# Altium project usomiq-bone-cape.PrjPcb
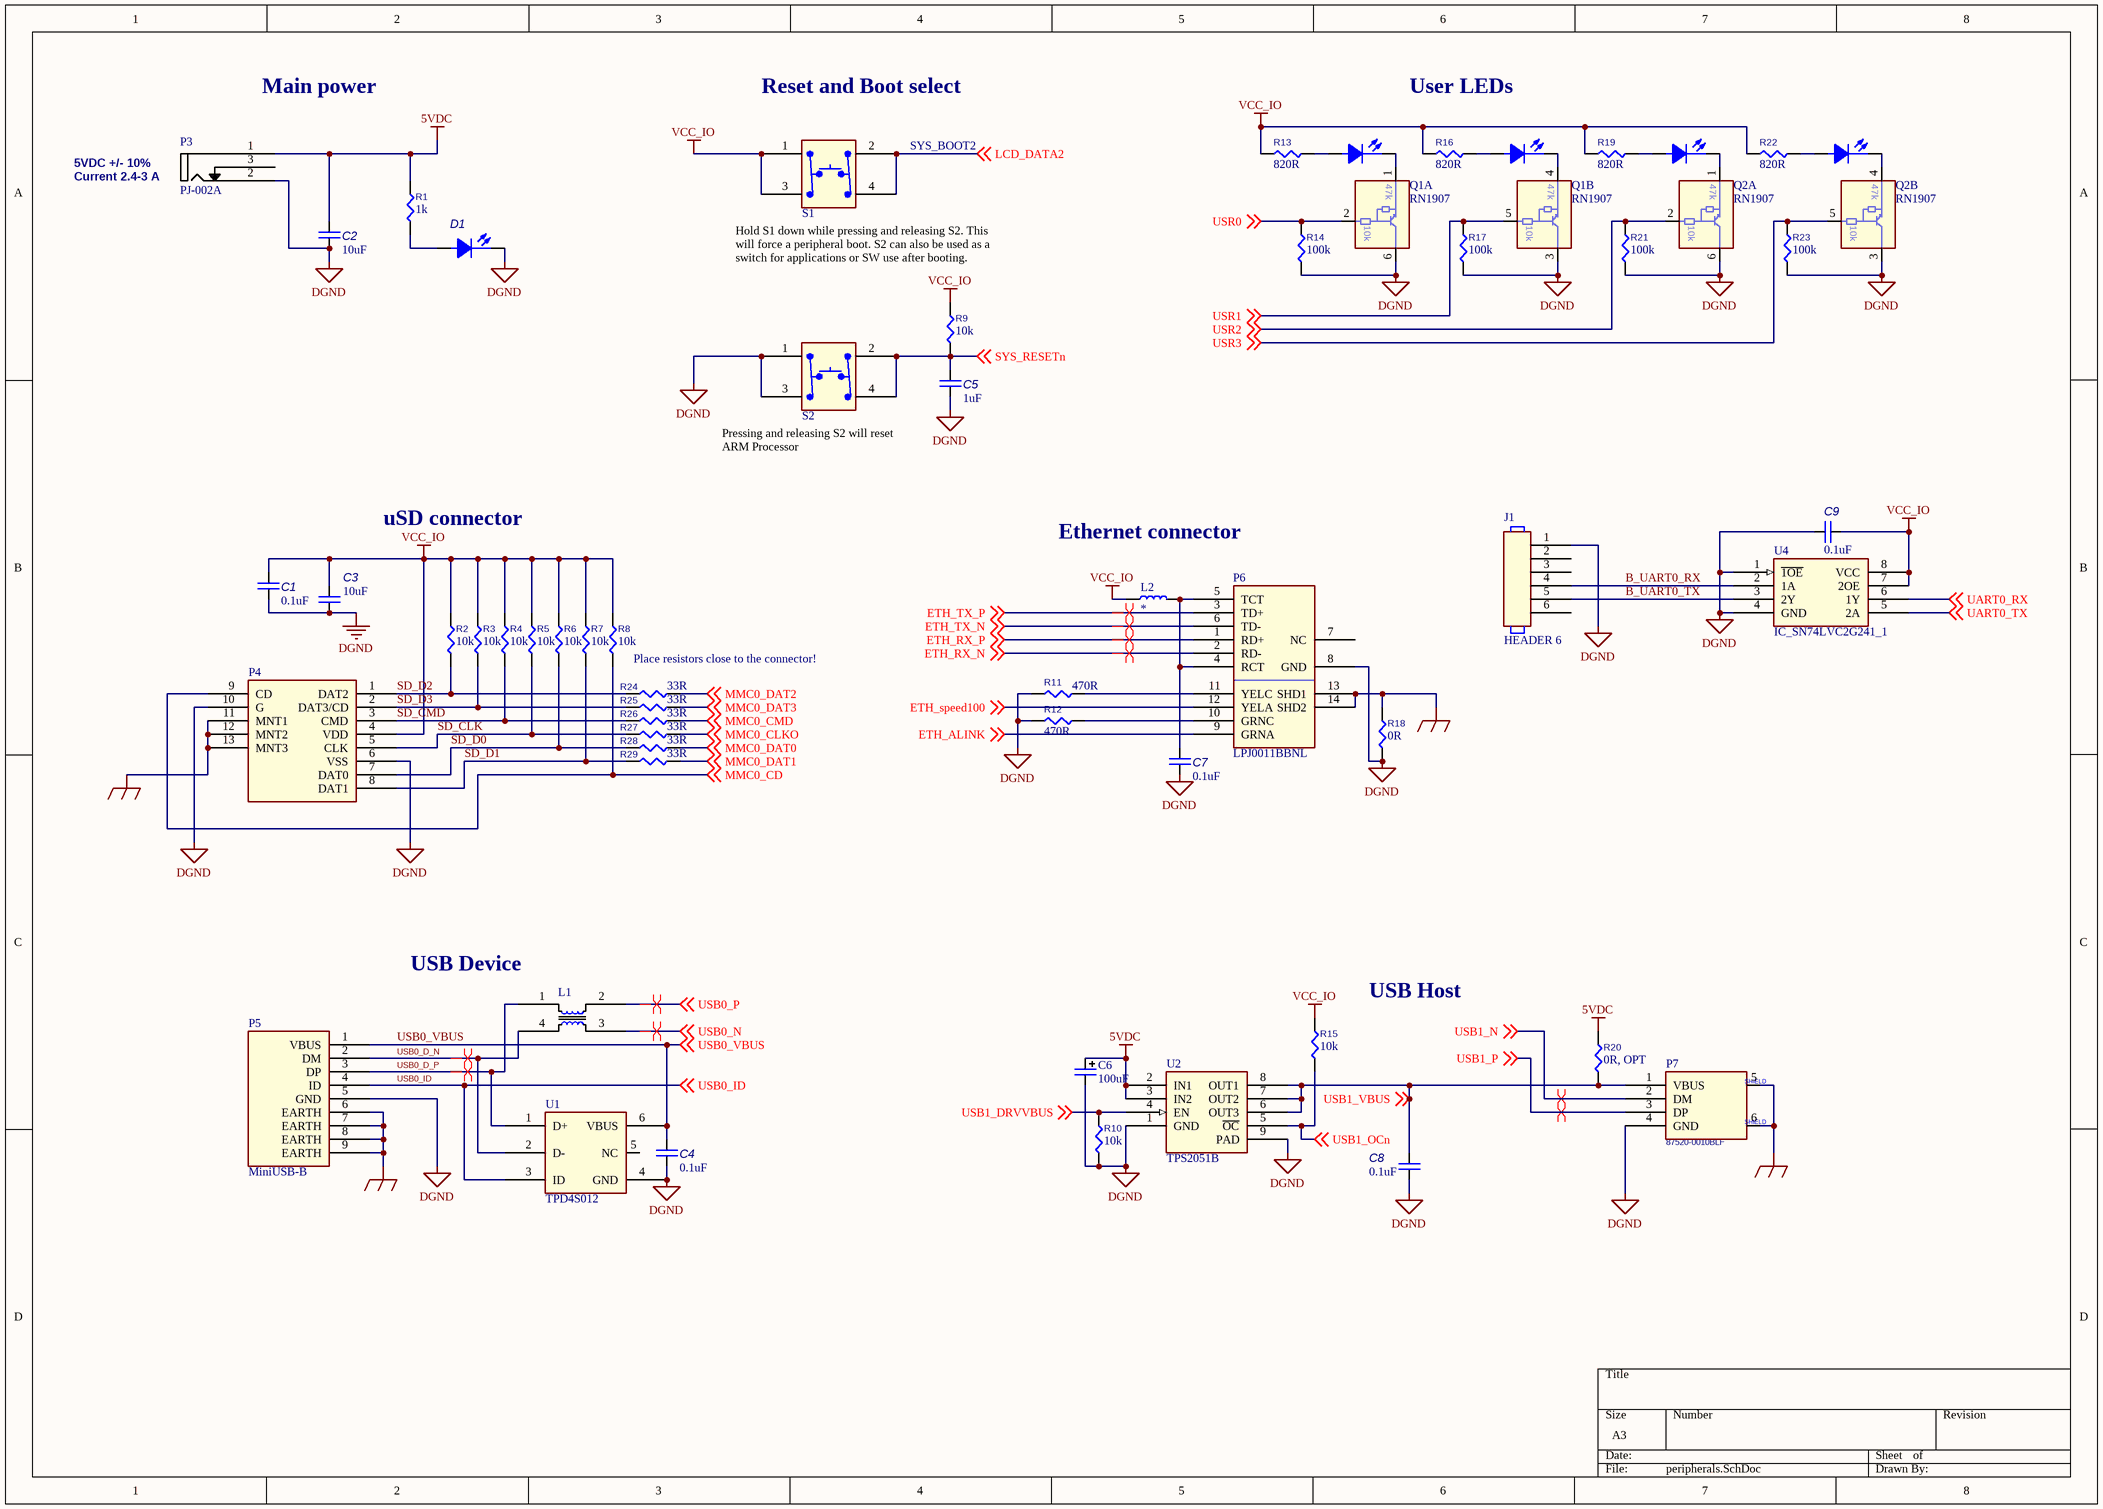
[diagram p0: peripherals.SchDoc]
2 sheets, 59 parts. Net scope: global (net labels, ports and power ports of the same name join across sheets).
Board file: usomiq-bone-cape.PcbDoc
Sheets:
  peripherals.SchDoc
  usomiq.SchDoc

## Sheet peripherals.SchDoc
size A3

### Parts
C1  value 0.1uF  [CC1608-0603]  (hidden comment: C0603)
C2  value 10uF  [CC2012-0805]  (hidden comment: C0805)
C3  value 10uF  [CC2012-0805]  (hidden comment: C0805)
C4  value 0.1uF  [CC1608-0603]  (hidden comment: C0603)
C5  value 1uF  [CC1608-0603]  (hidden comment: C0603)
C6  value 100uF  [Cap_C]  (hidden comment: Cap_C)
C7  value 0.1uF  [CC1608-0603]  (hidden comment: C0603)
C8  value 0.1uF  [CC1608-0603]  (hidden comment: C0603)
C9  value 0.1uF  [CC1608-0603]  (hidden comment: C0603)
D1  LED0805  [LED0805]  (value not drawn)
D2  LED0805  [LED0805]  (value not drawn)
D3  LED0805  [LED0805]  (value not drawn)
D4  LED0805  [LED0805]  (value not drawn)
D5  LED0805  [LED0805]  (value not drawn)
J1  HEADER 6  [DIP6]
L1  DLW21H  [DLW21H]  (value not drawn)
L2  BLM18A-FB  [CHIP0603]  (value not drawn)
P3  PJ-002A  [PJ-002A]
P4  (no value)  [TFC08WP01F-A-R1K-H]
P5  MiniUSB-B  [MINI-USB-B5 SMT]
P6  P/N: LPJ0011BBNL  [TRJ0011ABNL]  (hidden comment: CONN_RJ45_MAG_WE_0)
P7  P/N: 87520-0010BLF  [USB2.5-2H4C]  (hidden comment: CONN_54819-0578_2)
Q1  RN1907  [SOT363-6L]  (parts A,B of 2)
Q2  RN1907  [SOT363-6L]  (parts A,B of 2)
R1  value 1k  [RESC1608X55N]  (hidden comment: R0603)
R2  value 10k  [RESC1608X55N]  (hidden comment: R0603)
R3  value 10k  [RESC1608X55N]  (hidden comment: R0603)
R4  value 10k  [RESC1608X55N]  (hidden comment: R0603)
R5  value 10k  [RESC1608X55N]  (hidden comment: R0603)
R6  value 10k  [RESC1608X55N]  (hidden comment: R0603)
R7  value 10k  [RESC1608X55N]  (hidden comment: R0603)
R8  value 10k  [RESC1608X55N]  (hidden comment: R0603)
R9  value 10k  [RESC1608X55N]  (hidden comment: R0603)
R10  value 10k  [RESC1608X55N]  (hidden comment: R0603)
R11  value 470R  [RESC1608X55N]  (hidden comment: R0603)
R12  value 470R  [RESC1608X55N]  (hidden comment: R0603)
R13  value 820R  [RESC1608X55N]  (hidden comment: R0603)
R14  value 100k  [RESC1608X55N]  (hidden comment: R0603)
R15  value 10k  [RESC1608X55N]  (hidden comment: R0603)
R16  value 820R  [RESC1608X55N]  (hidden comment: R0603)
R17  value 100k  [RESC1608X55N]  (hidden comment: R0603)
R18  value 0R  [RESC1608X55N]  (hidden comment: R0603)
R19  value 820R  [RESC1608X55N]  (hidden comment: R0603)
R20  value 0R, OPT  [RESC1608X55N]  (hidden comment: R0603)
R21  value 100k  [RESC1608X55N]  (hidden comment: R0603)
R22  value 820R  [RESC1608X55N]  (hidden comment: R0603)
R23  value 100k  [RESC1608X55N]  (hidden comment: R0603)
R24  value 33R  [RESC1608X55N]  (hidden comment: R0603)
R25  value 33R  [RESC1608X55N]  (hidden comment: R0603)
R26  value 33R  [RESC1608X55N]  (hidden comment: R0603)
R27  value 33R  [RESC1608X55N]  (hidden comment: R0603)
R28  value 33R  [RESC1608X55N]  (hidden comment: R0603)
R29  value 33R  [RESC1608X55N]  (hidden comment: R0603)
S1  SW_KT11P2JM_2  [KMR231GLFS]  (value not drawn)
S2  SW_KT11P2JM_2  [KMR231GLFS]  (value not drawn)
U1  TPD4S012  [s-puson-n6]
U2  TPS2051B  [R-PDSO-G8]
U4  IC_SN74LVC2G241_1  [SOP127P600-8N]

### Nets
5VDC: C2.2 C6.1 P3.1(GND) R1.2 R20.2 U2.2(IN1) U2.3(IN2)
DGND: C1.2 C2.1 C3.1 C4.2 C5.2 C6.2 C7.2 C8.1 C9.1 D1.2(C) J1.1 P3.2(RIGHT) P4.6(VSS) P4.10(G) P5.5(GND) P6.8(GND) P7.4(GND) Q1.3 Q1.6 Q2.3 Q2.6 R10.1 R11.1 R12.1 R14.1 R17.1 R18.1 R21.1 R23.1 S2.1(A1) S2.3(A2) U1.4(GND) U2.1(GND) U2.9(PAD) U4.1(~{1OE}) U4.4(GND)
EARTH: P4.11(MNT1) P4.12(MNT2) P4.13(MNT3) P5.6(EARTH) P5.7(EARTH) P5.8(EARTH) P5.9(EARTH) P6.13(SHD1) P6.14(SHD2) P7.5(SHELD1) P7.6(PAD4) R18.2
VCC_IO: C1.1 C3.2 C9.2 L2.1 P4.4(VDD) R2.2 R3.2 R4.2 R5.2 R6.2 R7.2 R8.2 R9.2 R13.2 R15.2 R16.2 R19.2 R22.2 S1.1(A1) S1.3(A2) U4.7(2OE) U4.8(VCC)
B_UART0_RX: J1.4 U4.2(1A)
B_UART0_TX: J1.5 U4.3(2Y)
ETH_ALINK: P6.9(GRNA) ; off-sheet ETH_ALINK
ETH_RX_N: P6.2(RD-) ; off-sheet ETH_RX_N
ETH_RX_P: P6.1(RD+) ; off-sheet ETH_RX_P
ETH_speed100: P6.12(YELA) ; off-sheet ETH_speed100
ETH_TX_N: P6.6(TD-) ; off-sheet ETH_TX_N
ETH_TX_P: P6.3(TD+) ; off-sheet ETH_TX_P
LCD_DATA2: S1.2(B1) S1.4(B2) ; off-sheet LCD_DATA2
MMC0_CD: P4.9(CD) R8.1 ; off-sheet MMC0_CD
MMC0_CLKO: R27.2 ; off-sheet MMC0_CLKO
MMC0_CMD: R26.2 ; off-sheet MMC0_CMD
MMC0_DAT0: R28.2 ; off-sheet MMC0_DAT0
MMC0_DAT1: R29.2 ; off-sheet MMC0_DAT1
MMC0_DAT2: R24.2 ; off-sheet MMC0_DAT2
MMC0_DAT3: R25.2 ; off-sheet MMC0_DAT3
SD_CLK: P4.5(CLK) R5.1 R27.1
SD_CMD: P4.3(CMD) R4.1 R26.1
SD_D0: P4.7(DAT0) R6.1 R28.1
SD_D1: P4.8(DAT1) R7.1 R29.1
SD_D2: P4.1(DAT2) R2.1 R24.1
SD_D3: P4.2(DAT3/CD) R3.1 R25.1
SYS_RESETn: C5.1 R9.1 S2.2(B1) S2.4(B2) ; off-sheet SYS_RESETn
UART0_RX: U4.6(1Y) ; off-sheet UART0_RX
UART0_TX: U4.5(2A) ; off-sheet UART0_TX
USB0_D_N: L1.4 P5.2(DM) U1.2(D-)
USB0_D_P: L1.1 P5.3(DP) U1.1(D+)
USB0_ID: P5.4(ID) U1.3(ID) ; off-sheet USB0_ID
USB0_N: L1.3 ; off-sheet USB0_N
USB0_P: L1.2 ; off-sheet USB0_P
USB0_VBUS: C4.1 P5.1(VBUS) U1.6(VBUS) ; off-sheet USB0_VBUS
USB1_DRVVBUS: R10.2 U2.4(EN) ; off-sheet USB1_DRVVBUS
USB1_N: P7.2(DM) ; off-sheet USB1_N
USB1_OCn: R15.1 U2.5(~{OC}) ; off-sheet USB1_OCn
USB1_P: P7.3(DP) ; off-sheet USB1_P
USB1_VBUS: C8.2 P7.1(VBUS) R20.1 U2.6(OUT3) U2.7(OUT2) U2.8(OUT1) ; off-sheet USB1_VBUS
USR0: Q1.2 R14.2 ; off-sheet USR0
USR1: Q1.5 R17.2 ; off-sheet USR1
USR2: Q2.2 R21.2 ; off-sheet USR2
USR3: Q2.5 R23.2 ; off-sheet USR3
NetC7_1: C7.1 L2.2 P6.4(RCT) P6.5(TCT)
NetD1_1: D1.1(A) R1.1
NetD2_1: D2.1(A) R13.1
NetD2_2: D2.2(C) Q1.1
NetD3_1: D3.1(A) R16.1
NetD3_2: D3.2(C) Q1.4
NetD4_1: D4.1(A) R19.1
NetD4_2: D4.2(C) Q2.1
NetD5_1: D5.1(A) R22.1
NetD5_2: D5.2(C) Q2.4
NetP6_10: P6.10(GRNC) R12.2
NetP6_11: P6.11(YELC) R11.2

Not connected (* = marked no-connect by the designer): J1 2 3 6; P3 3(LEFT); P6 7(NC); U1 5(NC)

### Layout directives
differential pair: ETH_RX_N, ETH_RX_P, ETH_TX_N, ETH_TX_P, USB0_D_N, USB0_D_P, USB0_N, USB0_P, USB1_N, USB1_P

### Notes on the sheet
- Main power
- Reset and Boot select
- User LEDs
- SYS_BOOT2
- 5VDC +/- 10%
  Current 2.4-3 A
- Hold S1 down while pressing and releasing S2. This
  will force a peripheral boot. S2 can also be used as a
  switch for applications or SW use after booting.
- (near S2) Pressing and releasing S2 will reset ARM Processor
- uSD connector
- Ethernet connector
- Place resistors close to the connector!
- (near L1) USB Device
- USB Host
- (in symbol CONN_54819-0578_2) SHIELD

### Library data of the parts
C6 = Cap_C: Tantalum Capacitor Case C; P/N: *
D1-D5 = LED0805: LED 0805; Value: *
J1 = HEADER 6: CONN HEADER 6POS, VERTICAL,  .100 STR TIN; Mfr: FCI; P/N: 68000-406HLF
L1 = DLW21H: Low profile wire-wound common choke coil; Manufacturer: Murata; Man P/N: DLW21HN900SQ2
L2 = BLM18A-FB: Chip EMIFILr Inductor Type; Manufacturer: Murata; Man P/N: *
P3 = PJ-002A: DC POWER JACK; Manufacturer: CIU Inc; Vendor: Digi-key; Alternative P/N: DJK-02A; Man P/N: PJ-002A
P4 = TFC08WP01F-R1K-H-CN: Connector for microSD™ Card (Push-push Type); Mfr: AUK Contractors Co, LTD; P/N: TFC08WP01F-R1K-H-CN
P5 = MiniUSB-B: Mini USB Type B CONNECTOR; Mfr: Hirose; P/N: UX60SC-MB-5ST(80)
P6 = CONN_RJ45_MAG_WE_0: RJ-45 10/100 W/Magnetics; Mfr: Link PP; P/N-2: Wurth 7499011212
P7 = CONN_54819-0578_2: USB Type A Connectors; Mfr: FCI
Q1 Q2 = RN1907: Transistor Silicon NPN; Mfr: Panasonic; P/N: DMC564040R
S1 S2 = SW_KT11P2JM_2: SMD button; Mfr: C&K Components; P/N: KMR231GLFS
U1 = TPD4S012: 4-Channel USB ESD Solution with Power Clamp; Mfr: TI; P/N: TPD4S012DRYR
U2 = TPS2051B: CURRENT-LIMITED, POWER-DISTRIBUTION SWITCHES; Mfr: TI; P/N: TPS2051BDGN
U4 = IC_SN74LVC2G241_1: Dual Buffer/Driver With 3-State Outputs; Mfr: TI; P/N: SN74LVC2G241DCU
C1 C4 C5 C7-C9 = C0603: P/N: *
C2 C3 = C0805: P/N: *
R1-R29 = R0603: P/N: *

## Sheet usomiq.SchDoc
size A4
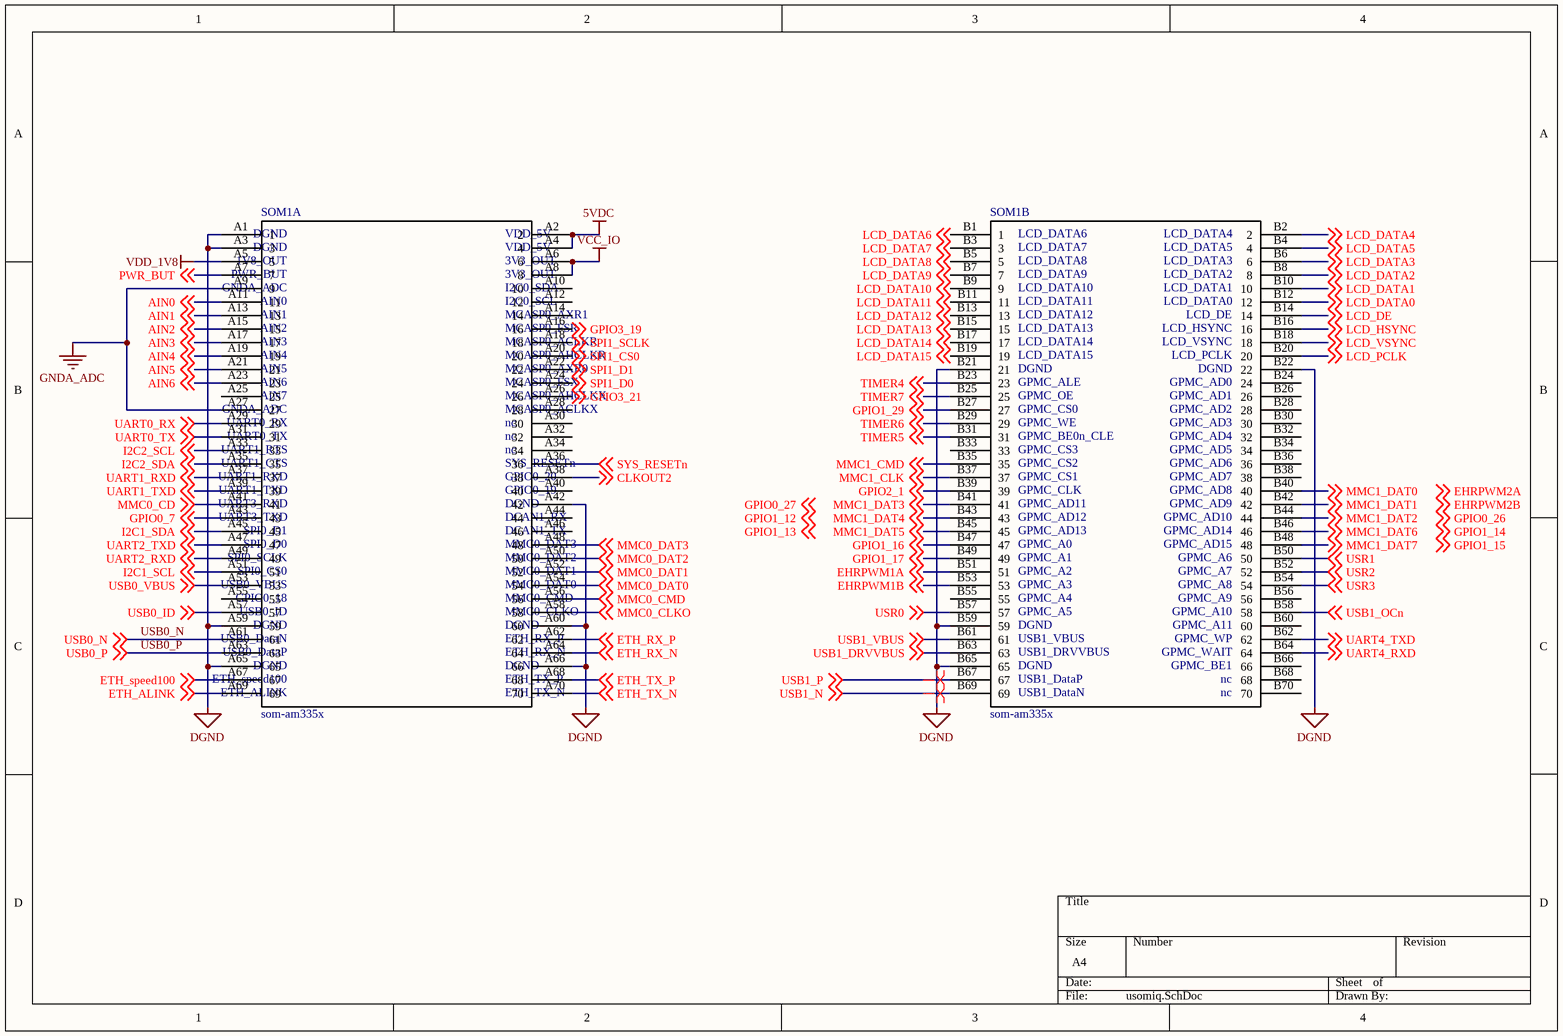
[diagram p1: usomiq.SchDoc]

### Parts
SOM1  som-am335x  [am3359_module-sockets]  (parts A,B of 2)

### Nets
5VDC: SOM1.A2(2) SOM1.A4(4)
DGND: SOM1.A1(1) SOM1.A3(3) SOM1.A42(42) SOM1.A59(59) SOM1.A60(60) SOM1.A65(65) SOM1.A66(66) SOM1.B21(21) SOM1.B22(22) SOM1.B59(59) SOM1.B65(65)
GNDA_ADC: SOM1.A9(9) SOM1.A27(27)
VCC_IO: SOM1.A6(6) SOM1.A8(8)
VDD_1V8: SOM1.A5(5)
AIN0: SOM1.A11(11) ; off-sheet AIN0
AIN1: SOM1.A13(13) ; off-sheet AIN1
AIN2: SOM1.A15(15) ; off-sheet AIN2
AIN3: SOM1.A17(17) ; off-sheet AIN3
AIN4: SOM1.A19(19) ; off-sheet AIN4
AIN5: SOM1.A21(21) ; off-sheet AIN5
AIN6: SOM1.A23(23) ; off-sheet AIN6
CLKOUT2: SOM1.A38(38) ; off-sheet CLKOUT2
EHRPWM1A: SOM1.B51(51) ; off-sheet EHRPWM1A
EHRPWM1B: SOM1.B53(53) ; off-sheet EHRPWM1B
ETH_ALINK: SOM1.A69(69) ; off-sheet ETH_ALINK
ETH_RX_N: SOM1.A64(64) ; off-sheet ETH_RX_N
ETH_RX_P: SOM1.A62(62) ; off-sheet ETH_RX_P
ETH_speed100: SOM1.A67(67) ; off-sheet ETH_speed100
ETH_TX_N: SOM1.A70(70) ; off-sheet ETH_TX_N
ETH_TX_P: SOM1.A68(68) ; off-sheet ETH_TX_P
GPIO0_7: SOM1.A43(43) ; off-sheet GPIO0_7
GPIO1_16: SOM1.B47(47) ; off-sheet GPIO1_16
GPIO1_17: SOM1.B49(49) ; off-sheet GPIO1_17
GPIO1_29: SOM1.B27(27) ; off-sheet GPIO1_29
GPIO2_1: SOM1.B39(39) ; off-sheet GPIO2_1
GPIO3_19: SOM1.A16(16) ; off-sheet GPIO3_19
GPIO3_21: SOM1.A26(26) ; off-sheet GPIO3_21
I2C1_SCL: SOM1.A51(51) ; off-sheet I2C1_SCL
I2C1_SDA: SOM1.A45(45) ; off-sheet I2C1_SDA
I2C2_SCL: SOM1.A33(33) ; off-sheet I2C2_SCL
I2C2_SDA: SOM1.A35(35) ; off-sheet I2C2_SDA
LCD_DATA0: SOM1.B12(12) ; off-sheet LCD_DATA0
LCD_DATA1: SOM1.B10(10) ; off-sheet LCD_DATA1
LCD_DATA2: SOM1.B8(8) ; off-sheet LCD_DATA2
LCD_DATA3: SOM1.B6(6) ; off-sheet LCD_DATA3
LCD_DATA4: SOM1.B2(2) ; off-sheet LCD_DATA4
LCD_DATA5: SOM1.B4(4) ; off-sheet LCD_DATA5
LCD_DATA6: SOM1.B1(1) ; off-sheet LCD_DATA6
LCD_DATA7: SOM1.B3(3) ; off-sheet LCD_DATA7
LCD_DATA8: SOM1.B5(5) ; off-sheet LCD_DATA8
LCD_DATA9: SOM1.B7(7) ; off-sheet LCD_DATA9
LCD_DATA10: SOM1.B9(9) ; off-sheet LCD_DATA10
LCD_DATA11: SOM1.B11(11) ; off-sheet LCD_DATA11
LCD_DATA12: SOM1.B13(13) ; off-sheet LCD_DATA12
LCD_DATA13: SOM1.B15(15) ; off-sheet LCD_DATA13
LCD_DATA14: SOM1.B17(17) ; off-sheet LCD_DATA14
LCD_DATA15: SOM1.B19(19) ; off-sheet LCD_DATA15
LCD_DE: SOM1.B14(14) ; off-sheet LCD_DE
LCD_HSYNC: SOM1.B16(16) ; off-sheet LCD_HSYNC
LCD_PCLK: SOM1.B20(20) ; off-sheet LCD_PCLK
LCD_VSYNC: SOM1.B18(18) ; off-sheet LCD_VSYNC
MMC0_CD: SOM1.A41(41) ; off-sheet MMC0_CD
MMC0_CLKO: SOM1.A58(58) ; off-sheet MMC0_CLKO
MMC0_CMD: SOM1.A56(56) ; off-sheet MMC0_CMD
MMC0_DAT0: SOM1.A54(54) ; off-sheet MMC0_DAT0
MMC0_DAT1: SOM1.A52(52) ; off-sheet MMC0_DAT1
MMC0_DAT2: SOM1.A50(50) ; off-sheet MMC0_DAT2
MMC0_DAT3: SOM1.A48(48) ; off-sheet MMC0_DAT3
MMC1_CLK: SOM1.B37(37) ; off-sheet MMC1_CLK
MMC1_CMD: SOM1.B35(35) ; off-sheet MMC1_CMD
MMC1_DAT0: SOM1.B40(40) ; off-sheet MMC1_DAT0
MMC1_DAT1: SOM1.B42(42) ; off-sheet MMC1_DAT1
MMC1_DAT2: SOM1.B44(44) ; off-sheet MMC1_DAT2
MMC1_DAT3: SOM1.B41(41) ; off-sheet MMC1_DAT3
MMC1_DAT4: SOM1.B43(43) ; off-sheet MMC1_DAT4
MMC1_DAT5: SOM1.B45(45) ; off-sheet MMC1_DAT5
MMC1_DAT6: SOM1.B46(46) ; off-sheet MMC1_DAT6
MMC1_DAT7: SOM1.B48(48) ; off-sheet MMC1_DAT7
PWR_BUT: SOM1.A7(7) ; off-sheet PWR_BUT
SPI1_CS0: SOM1.A20(20) ; off-sheet SPI1_CS0
SPI1_D0: SOM1.A24(24) ; off-sheet SPI1_D0
SPI1_D1: SOM1.A22(22) ; off-sheet SPI1_D1
SPI1_SCLK: SOM1.A18(18) ; off-sheet SPI1_SCLK
SYS_RESETn: SOM1.A36(36) ; off-sheet SYS_RESETn
TIMER4: SOM1.B23(23) ; off-sheet TIMER4
TIMER5: SOM1.B31(31) ; off-sheet TIMER5
TIMER6: SOM1.B29(29) ; off-sheet TIMER6
TIMER7: SOM1.B25(25) ; off-sheet TIMER7
UART0_RX: SOM1.A29(29) ; off-sheet UART0_RX
UART0_TX: SOM1.A31(31) ; off-sheet UART0_TX
UART1_RXD: SOM1.A37(37) ; off-sheet UART1_RXD
UART1_TXD: SOM1.A39(39) ; off-sheet UART1_TXD
UART2_RXD: SOM1.A49(49) ; off-sheet UART2_RXD
UART2_TXD: SOM1.A47(47) ; off-sheet UART2_TXD
UART4_RXD: SOM1.B64(64) ; off-sheet UART4_RXD
UART4_TXD: SOM1.B62(62) ; off-sheet UART4_TXD
USB0_ID: SOM1.A57(57) ; off-sheet USB0_ID
USB0_N: SOM1.A61(61) ; off-sheet USB0_N
USB0_P: SOM1.A63(63) ; off-sheet USB0_P
USB0_VBUS: SOM1.A53(53) ; off-sheet USB0_VBUS
USB1_DRVVBUS: SOM1.B63(63) ; off-sheet USB1_DRVVBUS
USB1_N: SOM1.B69(69) ; off-sheet USB1_N
USB1_OCn: SOM1.B58(58) ; off-sheet USB1_OCn
USB1_P: SOM1.B67(67) ; off-sheet USB1_P
USB1_VBUS: SOM1.B61(61) ; off-sheet USB1_VBUS
USR0: SOM1.B57(57) ; off-sheet USR0
USR1: SOM1.B50(50) ; off-sheet USR1
USR2: SOM1.B52(52) ; off-sheet USR2
USR3: SOM1.B54(54) ; off-sheet USR3

Not connected (* = marked no-connect by the designer): SOM1 A10(10) A12(12) A14(14) A25(25) A28(28) A30(30) A32(32) A34(34) A40(40) A44(44) A46(46) A55(55) B24(24) B26(26) B28(28) B30(30) B32(32) B33(33) B34(34) B36(36) B38(38) B55(55) B56(56) B60(60) B66(66) B68(68) B70(70)

### Layout directives
differential pair: USB1_N, USB1_P

### Notes on the sheet
- Labels drawn without touching a wire or pin: EHRPWM2A, EHRPWM2B, GPIO0_26, GPIO0_27, GPIO1_12, GPIO1_13, GPIO1_14, GPIO1_15
- (in symbol som-am335x, part B) LCD_DATA6; LCD_DATA4; LCD_DATA7; LCD_DATA5; LCD_DATA8; LCD_DATA3; LCD_DATA9; LCD_DATA2; LCD_DATA10; LCD_DATA1; LCD_DATA11; LCD_DATA0; LCD_DATA12; LCD_DE; LCD_DATA13; LCD_HSYNC; LCD_DATA14; LCD_VSYNC; LCD_DATA15; LCD_PCLK; DGND; GPMC_ALE; GPMC_AD0; GPMC_OE; GPMC_AD1; GPMC_CS0; GPMC_AD2; GPMC_WE; GPMC_AD3; GPMC_BE0n_CLE; GPMC_AD4; GPMC_CS3; GPMC_AD5; GPMC_CS2; GPMC_AD6; GPMC_CS1; GPMC_AD7; GPMC_CLK; GPMC_AD8; GPMC_AD11; GPMC_AD9; GPMC_AD12; GPMC_AD10; GPMC_AD13; GPMC_AD14; GPMC_A0; GPMC_AD15; GPMC_A1; GPMC_A6; GPMC_A2; GPMC_A7; GPMC_A3; GPMC_A8; GPMC_A4; GPMC_A9; GPMC_A5; GPMC_A10; GPMC_A11; USB1_VBUS; GPMC_WP; USB1_DRVVBUS; GPMC_WAIT; GPMC_BE1; USB1_DataP; nc; USB1_DataN

## Nets that join several sheets
5VDC: peripherals (7 pins), usomiq (SOM1.A2 SOM1.A4)
DGND: peripherals (36 pins), usomiq (11 pins)
VCC_IO: peripherals (22 pins), usomiq (SOM1.A6 SOM1.A8)
ETH_ALINK: peripherals (P6.9), usomiq (SOM1.A69)
ETH_RX_N: peripherals (P6.2), usomiq (SOM1.A64)
ETH_RX_P: peripherals (P6.1), usomiq (SOM1.A62)
ETH_speed100: peripherals (P6.12), usomiq (SOM1.A67)
ETH_TX_N: peripherals (P6.6), usomiq (SOM1.A70)
ETH_TX_P: peripherals (P6.3), usomiq (SOM1.A68)
LCD_DATA2: peripherals (S1.2 S1.4), usomiq (SOM1.B8)
MMC0_CD: peripherals (P4.9 R8.1), usomiq (SOM1.A41)
MMC0_CLKO: peripherals (R27.2), usomiq (SOM1.A58)
MMC0_CMD: peripherals (R26.2), usomiq (SOM1.A56)
MMC0_DAT0: peripherals (R28.2), usomiq (SOM1.A54)
MMC0_DAT1: peripherals (R29.2), usomiq (SOM1.A52)
MMC0_DAT2: peripherals (R24.2), usomiq (SOM1.A50)
MMC0_DAT3: peripherals (R25.2), usomiq (SOM1.A48)
SYS_RESETn: peripherals (C5.1 R9.1 S2.2 S2.4), usomiq (SOM1.A36)
UART0_RX: peripherals (U4.6), usomiq (SOM1.A29)
UART0_TX: peripherals (U4.5), usomiq (SOM1.A31)
USB0_ID: peripherals (P5.4 U1.3), usomiq (SOM1.A57)
USB0_N: peripherals (L1.3), usomiq (SOM1.A61)
USB0_P: peripherals (L1.2), usomiq (SOM1.A63)
USB0_VBUS: peripherals (C4.1 P5.1 U1.6), usomiq (SOM1.A53)
USB1_DRVVBUS: peripherals (R10.2 U2.4), usomiq (SOM1.B63)
USB1_N: peripherals (P7.2), usomiq (SOM1.B69)
USB1_OCn: peripherals (R15.1 U2.5), usomiq (SOM1.B58)
USB1_P: peripherals (P7.3), usomiq (SOM1.B67)
USB1_VBUS: peripherals (6 pins), usomiq (SOM1.B61)
USR0: peripherals (Q1.2 R14.2), usomiq (SOM1.B57)
USR1: peripherals (Q1.5 R17.2), usomiq (SOM1.B50)
USR2: peripherals (Q2.2 R21.2), usomiq (SOM1.B52)
USR3: peripherals (Q2.5 R23.2), usomiq (SOM1.B54)